# Altium schematic sheet HDMI_To_MIPI.SchDoc
size A2
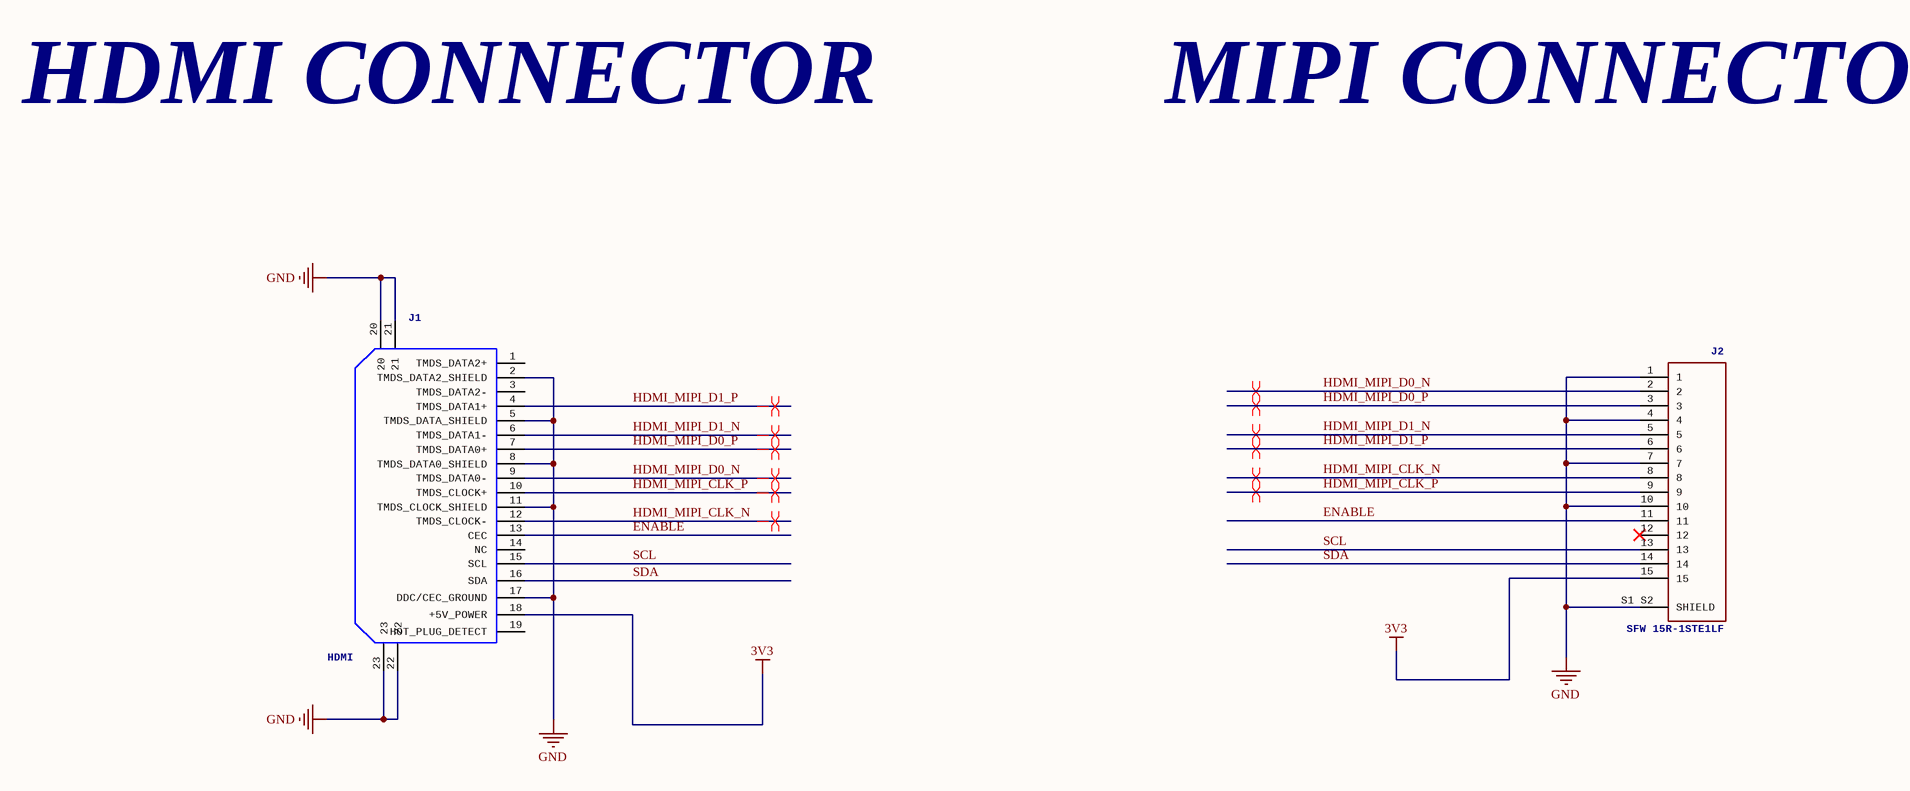
[diagram p0: HDMI_To_MIPI.SchDoc]

## Parts
J1  HDMI  [2000124100BK]
J2  SFW 15R-1STE1LF  [AMPHENOL_SFW15R-1STE1LF]

## Nets
3V3: J1.18(+5V_POWER) J2.15
GND: J1.2(TMDS_DATA2_SHIELD) J1.5(TMDS_DATA_SHIELD) J1.8(TMDS_DATA0_SHIELD) J1.11(TMDS_CLOCK_SHIELD) J1.17(DDC/CEC_GROUND) J1.20 J1.21 J1.22 J1.23 J2.1 J2.4 J2.7 J2.10 J2.S1_S2(SHIELD)
ENABLE: J1.13(CEC) J2.11
HDMI_MIPI_CLK_N: J1.12(TMDS_CLOCK-) J2.8
HDMI_MIPI_CLK_P: J1.10(TMDS_CLOCK+) J2.9
HDMI_MIPI_D0_N: J1.9(TMDS_DATA0-) J2.2
HDMI_MIPI_D0_P: J1.7(TMDS_DATA0+) J2.3
HDMI_MIPI_D1_N: J1.6(TMDS_DATA1-) J2.5
HDMI_MIPI_D1_P: J1.4(TMDS_DATA1+) J2.6
SCL: J1.15(SCL) J2.13
SDA: J1.16(SDA) J2.14

Not connected (* = marked no-connect by the designer): J1 1(TMDS_DATA2+) 3(TMDS_DATA2-) 14(NC) 19(HOT_PLUG_DETECT); J2 12*

## Layout directives
differential pair: HDMI_MIPI_CLK_N, HDMI_MIPI_CLK_P, HDMI_MIPI_D0_N, HDMI_MIPI_D0_P, HDMI_MIPI_D1_N, HDMI_MIPI_D1_P

## Notes on the sheet
- HDMI CONNECTOR
- MIPI CONNECTOR

## Library data of the parts
J1 = HDMI-normal: Manufacturer_Name: CNC Tech; GateName_1: G$1; SymbolName_1: 2000-1-2-41-00-BK; LibraryName: 2000-1-2-41-00-BK; DeviceSetName: 2000-1-2-41-00-BK; Package: 2000124100BK; Manufacturer_Part_Number: 2000-1-2-41-00-BK; Arrow_Part_Number: 2000-1-2-41-00-BK; Arrow_Price-Stock: https://www.arrow.com/en/products/2000-1-2-41-00-bk/cnc-tech-llc; Height: 6mm
J2 = HEADER15: GateName_1: G$1; MF: Amphenol ICC; SymbolName_1: SFW15R-1STE1LF; LibraryName: SFW15R-1STE1LF; DeviceSetName: SFW15R-1STE1LF; Package: AMPHENOL_SFW15R-1STE1LF; Digi-Key_Part_Number: 609-1905-1-ND; Package: None; DigiKey-Purchase-URL: https://snapeda.com/shop?store=DigiKey&id=2097159; Mouser-Purchase-URL: https://snapeda.com/shop?store=Mouser&id=2097159; MP: SFW15R-1STE1LF